# Altium schematic sheet Port K Output Port.SchDoc: Port K Output Port
size 292 x 193 mm; SheetNumber: 4; SheetTotal: 28
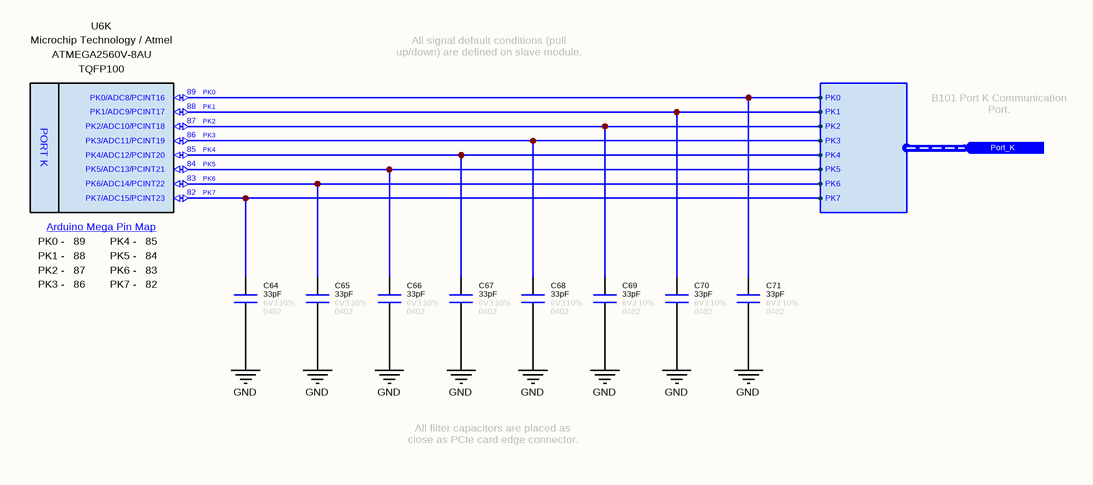
[diagram p0: Port K Output Port.SchDoc]

## Parts
C64  value 33pF  Tolerance: 10%  Case: 0402  Voltage: 6V3  [CAPACITOR_0402]  (hidden comment: Capacitor - 33pF [0402] (Ceramic))
C65  value 33pF  Tolerance: 10%  Case: 0402  Voltage: 6V3  [CAPACITOR_0402]  (hidden comment: Capacitor - 33pF [0402] (Ceramic))
C66  value 33pF  Tolerance: 10%  Case: 0402  Voltage: 6V3  [CAPACITOR_0402]  (hidden comment: Capacitor - 33pF [0402] (Ceramic))
C67  value 33pF  Tolerance: 10%  Case: 0402  Voltage: 6V3  [CAPACITOR_0402]  (hidden comment: Capacitor - 33pF [0402] (Ceramic))
C68  value 33pF  Tolerance: 10%  Case: 0402  Voltage: 6V3  [CAPACITOR_0402]  (hidden comment: Capacitor - 33pF [0402] (Ceramic))
C69  value 33pF  Tolerance: 10%  Case: 0402  Voltage: 6V3  [CAPACITOR_0402]  (hidden comment: Capacitor - 33pF [0402] (Ceramic))
C70  value 33pF  Tolerance: 10%  Case: 0402  Voltage: 6V3  [CAPACITOR_0402]  (hidden comment: Capacitor - 33pF [0402] (Ceramic))
C71  value 33pF  Tolerance: 10%  Case: 0402  Voltage: 6V3  [CAPACITOR_0402]  (hidden comment: Capacitor - 33pF [0402] (Ceramic))
U6  Manufacturer Name: Microchip Technology / Atmel  Case: TQFP100  [TQFP-100]  (hidden comment: ATMEGA2560V-8AU)  (part K of 16)

## Ports
Port_K (in, harness Port_K)

## Harnesses
Port_K: PK3, PK2, PK1, PK0, PK4, PK5, PK6, PK7

## Nets
GND: C64.1 C65.1 C66.1 C67.1 C68.1 C69.1 C70.1 C71.1
PK0: C71.2 U6.89(PK0/ADC8/PCINT16) ; port Port_K.PK0
PK1: C70.2 U6.88(PK1/ADC9/PCINT17) ; port Port_K.PK1
PK2: C69.2 U6.87(PK2/ADC10/PCINT18) ; port Port_K.PK2
PK3: C68.2 U6.86(PK3/ADC11/PCINT19) ; port Port_K.PK3
PK4: C67.2 U6.85(PK4/ADC12/PCINT20) ; port Port_K.PK4
PK5: C66.2 U6.84(PK5/ADC13/PCINT21) ; port Port_K.PK5
PK6: C65.2 U6.83(PK6/ADC14/PCINT22) ; port Port_K.PK6
PK7: C64.2 U6.82(PK7/ADC15/PCINT23) ; port Port_K.PK7

## Notes on the sheet
- All signal default conditions (pull up/down) are defined on slave module.
- B101 Port K Communication Port.
- All filter capacitors are placed as close as PCIe card edge connector.
- © 2021 All rights reserved.
  This document may not, in whole or in part, be copied, photocopied, reproduced, translated or converted to any electronic or machine readable from without prior written permission of Mehmet Günce Akkoyun.
  Engineer contact : akkoyun@me.com
- Property of
- Engineer :
- Date :
- Size :
- A4
- Time :
- Project :
- Page :
- /
- Customer :
- Product ID :
- Module ID :
- Version :
- File :
- Revision :
- (in symbol IC - AtMega2560V-8AU, part K) PORT K; Arduino Mega Pin Map; PK0 -; PK4 -; PK1 -; PK5 -; PK2 -; PK6 -; PK3 -; PK7 -

## Library data of the parts
C64-C71 = Capacitor - 33pF [0402-6V3]: Manufacturer Name: Kemet; Manufacturer Part Number: C0402C330J9RACAUTO; ComponentLink1Description: DataSheet; ComponentLink1URL: https://api.kemet.com/component-edge/download/datasheet/C0402C330J9RACAUTO.pdf; ComponentLink2Description: Mouser; ComponentLink2URL: https://www.mouser.com/Search/Refine.aspx?Keyword=80-C0402C330J9RAUTO
U6 = IC - AtMega2560V-8AU: ATmega Series 256 KB Flash 8 KB SRAM 8 MHz 8-Bit Microcontroller - TQFP-100; Program Memory Size: 256 kB; Core: AVR; Operating Supply Voltage: 2.7 V to 5.5 V; Maximum Clock Frequency: 8 MHz; Maximum Operating Temperature: + 85 C; Product Type: MicroControllers; Minimum Operating Temperature: - 40 C; Manufacturer Part Number: ATMEGA2560V-8AU